# Altium project Motorized_Blinds_PRJ.PrjPcb
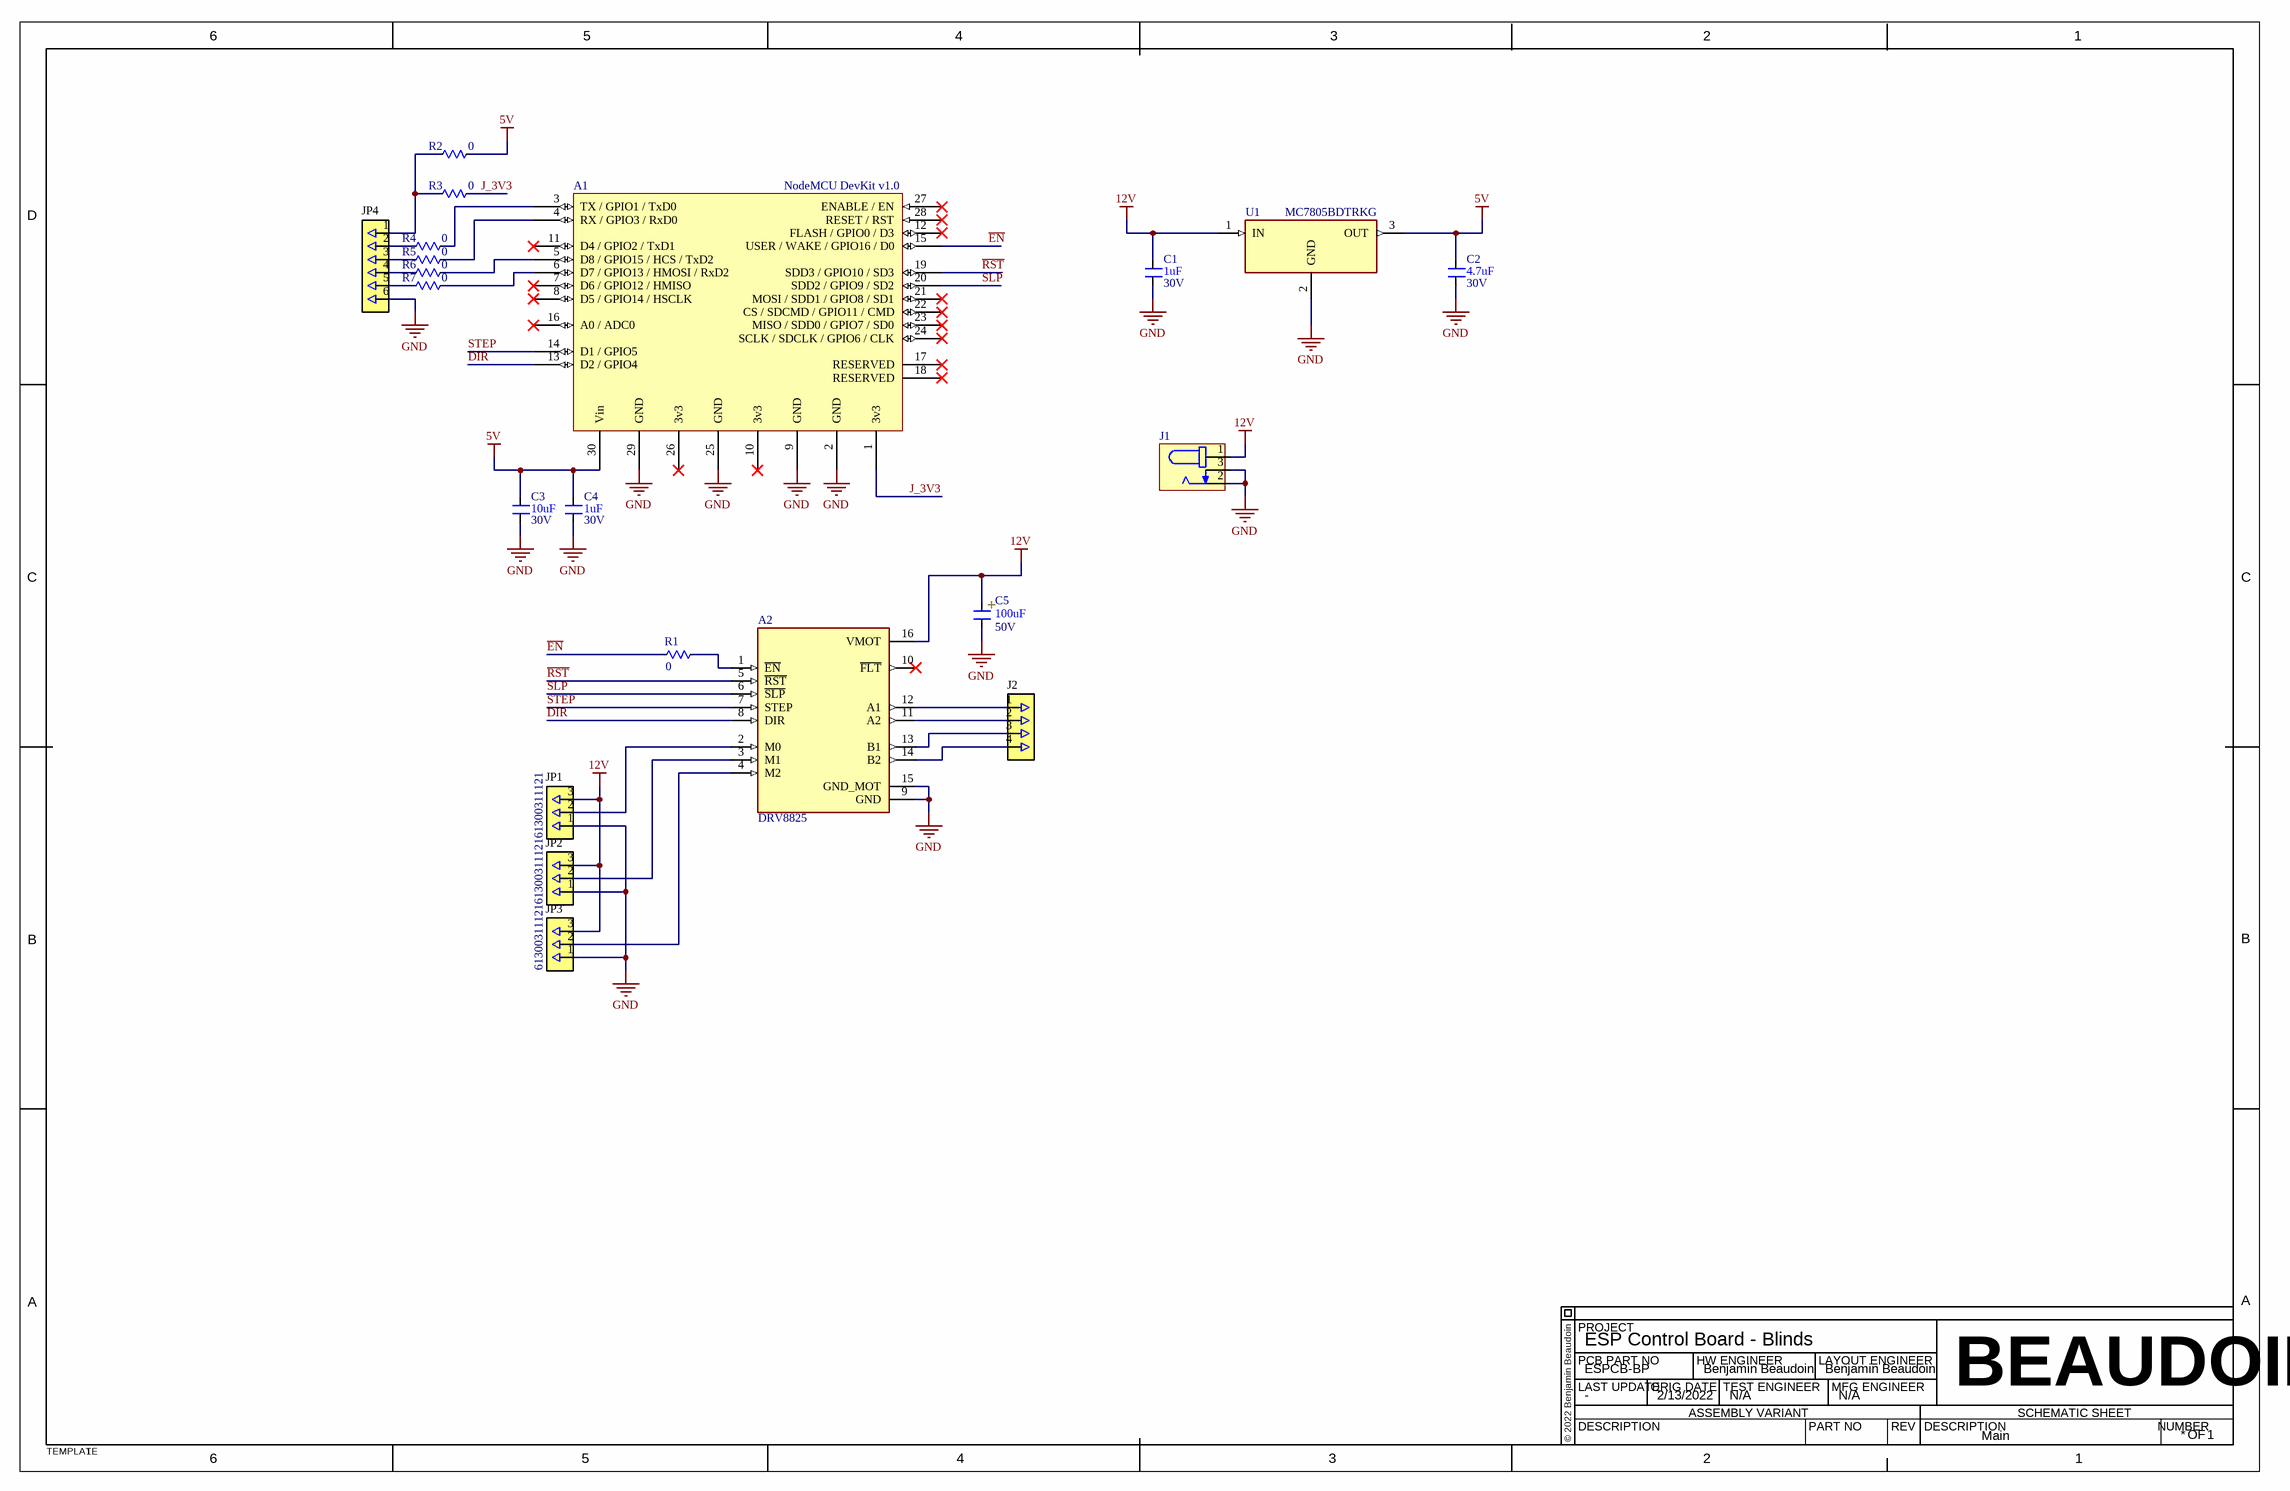
[diagram p0: Main_SCH.SchDoc]
PCB_PN: ESPCB-BP; PCB_Rev: A; Prj_Date: 2/13/2022; Prj_Engineer: Benjamin Beaudoin; Prj_Layout_Eng: Benjamin Beaudoin; Prj_Mfg_Eng: N/A; Prj_Mfg_Engineer: N/A; Prj_Test_Eng: N/A; Prj_Test_Engineer: N/A; Prj_Title: ESP Control Board - Blinds; Prj_Update: -; Revision: -
1 sheet, 21 parts. Net scope: flat (ports and power ports of the same name join across sheets).
Board file: Motorized_Blinds_PCB.PcbDoc

## Sheet Main_SCH.SchDoc
size Tabloid; Engineer: Benjamin Beaudoin; Organization: Private; SheetTotal: 1; PageSetup: Record=PageOptions|CenterHorizontal=True|CenterVertical=True|PrintScale=1.00|XCorrection=1.00|YCorrection=1.00|PrintKind=0|BorderSize=5000000|LeftOffset=0|BottomOffset=0|Orientation=2|PaperLength=1000|PaperWidth=1000|Scale=100|PaperSource=15|PrintQuality=1200|MediaType=1|DitherType=10|PrintScaleMode=0|PaperKind=11 x 17|PaperIndex=119; LayoutEngineer: Benjamin Beaudoin; Template_Version: 1; DocumentName: Main

### Parts
A1  NodeMCU DevKit v1.0  [NodeMCU DevKit v1.0 - No Labels]
A2  DRV8825  [IC_DRV8825_STEPPER_MOTOR_DRIVER_CARRIER]
C1  Vmax: 30V  [C0603]  (hidden comment: 1uF)
C2  Vmax: 30V  [C0603]  (hidden comment: 4.7uF)
C3  Vmax: 30V  [C0805]  (hidden comment: 10uF)
C4  Vmax: 30V  [C0603]  (hidden comment: 1uF)
C5  Vmax: 50V  [CAPAE1050X1050N]  (hidden comment: 100uF)
J1  PJ-036AH-SMT-TR  [CUI_PJ-036AH-SMT-TR]  (value not drawn)
J2  (no value)  [JP_J4_2.54mm]
JP1  61300311121  [JP_61300311121]
JP2  61300311121  [JP_61300311121]
JP3  61300311121  [JP_61300311121]
JP4  (no value)  [JP_J6_2.54mm]
R1  0  [R0603]
R2  0  [R0603]
R3  0  [R0603]
R4  0  [R0603]
R5  0  [R0603]
R6  0  [R0603]
R7  0  [R0603]
U1  MC7805BDTRKG  [DPAK229P990X238-4N]

### Nets
5V: A1.30(Vin) C2.1 C3.1 C4.1 R2.2 U1.3(OUT)
12V: A2.16(VMOT) C1.1 C5.1 J1.1 JP1.3 JP2.3 JP3.3 U1.1(IN)
GND: A1.2(GND) A1.9(GND) A1.25(GND) A1.29(GND) A2.9(GND) A2.15(GND_MOT) C1.2 C2.2 C3.2 C4.2 C5.2 J1.2 J1.3 JP1.1 JP2.1 JP3.1 JP4.6 U1.2(GND)
DIR: A1.13(D2_/_GPIO4) A2.8(DIR)
~{EN}: A1.15(USER_/_WAKE_/_GPIO16_/_D0) R1.1
J_3V3: A1.1(3v3) R3.2
~{RST}: A1.19(SDD3_/_GPIO10_/_SD3) A2.5(~{RST})
~{SLP}: A1.20(SDD2_/_GPIO9_/_SD2) A2.6(~{SLP})
STEP: A1.14(D1_/_GPIO5) A2.7(STEP)
NetA1_3: A1.3(TX_/_GPIO1_/_TxD0) R4.2
NetA1_4: A1.4(RX_/_GPIO3_/_RxD0) R5.2
NetA1_5: A1.5(D8_/_GPIO15_/_HCS_/_TxD2) R6.2
NetA1_6: A1.6(D7_/_GPIO13_/_HMOSI_/_RxD2) R7.2
NetA2_1: A2.1(~{EN}) R1.2
NetA2_2: A2.2(M0) JP1.2
NetA2_3: A2.3(M1) JP2.2
NetA2_4: A2.4(M2) JP3.2
NetA2_11: A2.11(A2) J2.2
NetA2_12: A2.12(A1) J2.1
NetA2_13: A2.13(B1) J2.3
NetA2_14: A2.14(B2) J2.4
NetJP4_1: JP4.1 R2.1 R3.1
NetJP4_2: JP4.2 R4.1
NetJP4_3: JP4.3 R5.1
NetJP4_4: JP4.4 R6.1
NetJP4_5: JP4.5 R7.1

Not connected (* = marked no-connect by the designer): A1 7(D6_/_GPIO12_/_HMISO)* 8(D5_/_GPIO14_/_HSCLK)* 10(3v3)* 11(D4_/_GPIO2_/_TxD1)* 12(FLASH_/_GPIO0_/_D3)* 16(A0_/_ADC0)* 17(RESERVED)* 18(RESERVED)* 21(MOSI_/_SDD1_/_GPIO8_/_SD1)* 22(CS_/_SDCMD_/_GPIO11_/_CMD)* 23(MISO_/_SDD0_/_GPIO7_/_SD0)* 24(SCLK_/_SDCLK_/_GPIO6_/_CLK)* 26(3v3)* 27(ENABLE_/_EN)* 28(RESET_/_RST)*; A2 10(~{FLT})*

### Notes on the sheet
- 6
- 5
- 4
- 3
- 2
- 1
- D
- C
- B
- A
- PROJECT
- PCB PART NO
- HW ENGINEER
- LAYOUT ENGINEER
- © 2022 Benjamin Beaudoin
- LAST UPDATE
- DESCRIPTION
- ORIG DATE
- TEST ENGINEER
- ASSEMBLY VARIANT
- PART NO
- MFG ENGINEER
- REV
- BEAUDOIN
- SCHEMATIC SHEET
- NUMBER
- TEMPLATE
- OF
- (in symbol CAP-Pol_MAL214699103E3) +

### Library data of the parts
A2 = DRV8825_STEPPER_MOTOR_DRIVER_CARRIER: DRV8825 Motor Controller/Driver Power Management Evaluation Board; Manufacturer: Pololu; MFPN: DRV8825 STEPPER MOTOR DRIVER CARRIER; Value: DRV8825
C1-C4 = CAP-NoPol: SMCAP NoPol
  C1 C4: Value: 1uF
  C2: Value: 4.7uF
  C3: Value: 10uF
C5 = CAP-Pol_MAL214699103E3: CAP ALUM 100UF 20% 50V SMD; Manufacturer: Vishay; MFPN: MAL214699103E3; Value: 100uF
J1 = PJ-036AH-SMT-TR: 2.0 x 6.3 mm, 5.0 A, Horizontal, Surface Mount _SMT_, Dc Power Jack Connector; Manufacturer: CUI Devices; Value: PJ-036AH-SMT-TR; MFPN: PJ-036AH-SMT-TR
J2 = JP_J4_2.54mm: CONN HEADER VERT 4POS 2.54MM
JP1-JP3 = JP_61300311121: CONN HEADER VERT 3POS 2.54MM; VALUE: 61300311121; MFPN: 61300311121
JP4 = JP_J6_2.54mm: CONN HEADER VERT 6POS 2.54MM
R1-R7 = Res: SMRES; Value: 0
U1 = MC7805BDTRKG: Linear Voltage Regulator IC 1 Output 1A DPAK; Manufacturer: ON Semiconductor; MFPN: MC7805BDTRKG; Value: MC7805BDTRKG
A1 = NodeMCU DevKit v1.0: MFPN: NodeMCU DevKit v1.0; Value: NodeMCU DevKit v1.0

## Assembly variants
DRL-1200-H: not fitted C10 C11 C12 C18 C20 C29 C30 D3 D4 D5 D6 D10 D15 D21 D22 D23 D24 D25 D26 F3 F6 F7 J2 J7 J11 J12 JP2 K2 L1 L4 L8 L9 LED1 LED2 LED3 LED4 LED5 LED6 Q1 Q5 R1 R2 R3 R4 R5 R6 R7 R9 R10 R12 R13 R14 R15 R16 R20 R29 R32 R33 R34 R35 R36 R37 R38 R39 R42 R43 R44 R45 R46 R47 R48 R49 R50 SW1 U1 U5
DRL-1200-G: not fitted R44 R45 U6